# Altium project SCB.PrjPCB (part 6 of 8)

## Sheet Power_Supply.SchDoc: Power_Supply
size A3; Date: 18/06/2014; DrawnBy: J. Gabriel R.E.; Organization: Seven Solutions S.L.; Address1: C/Baza, Parcela 19, Nave 3; Address2: Polígono Ind. Juncaril; Address3: 18210-Peligros-Granada; Address4: Spain; Revision: 3.4; SheetNumber: 2; SheetTotal: 23; WebAddress: www.sevensols.com; Project: White Rabbit; ProjectName: Project Name
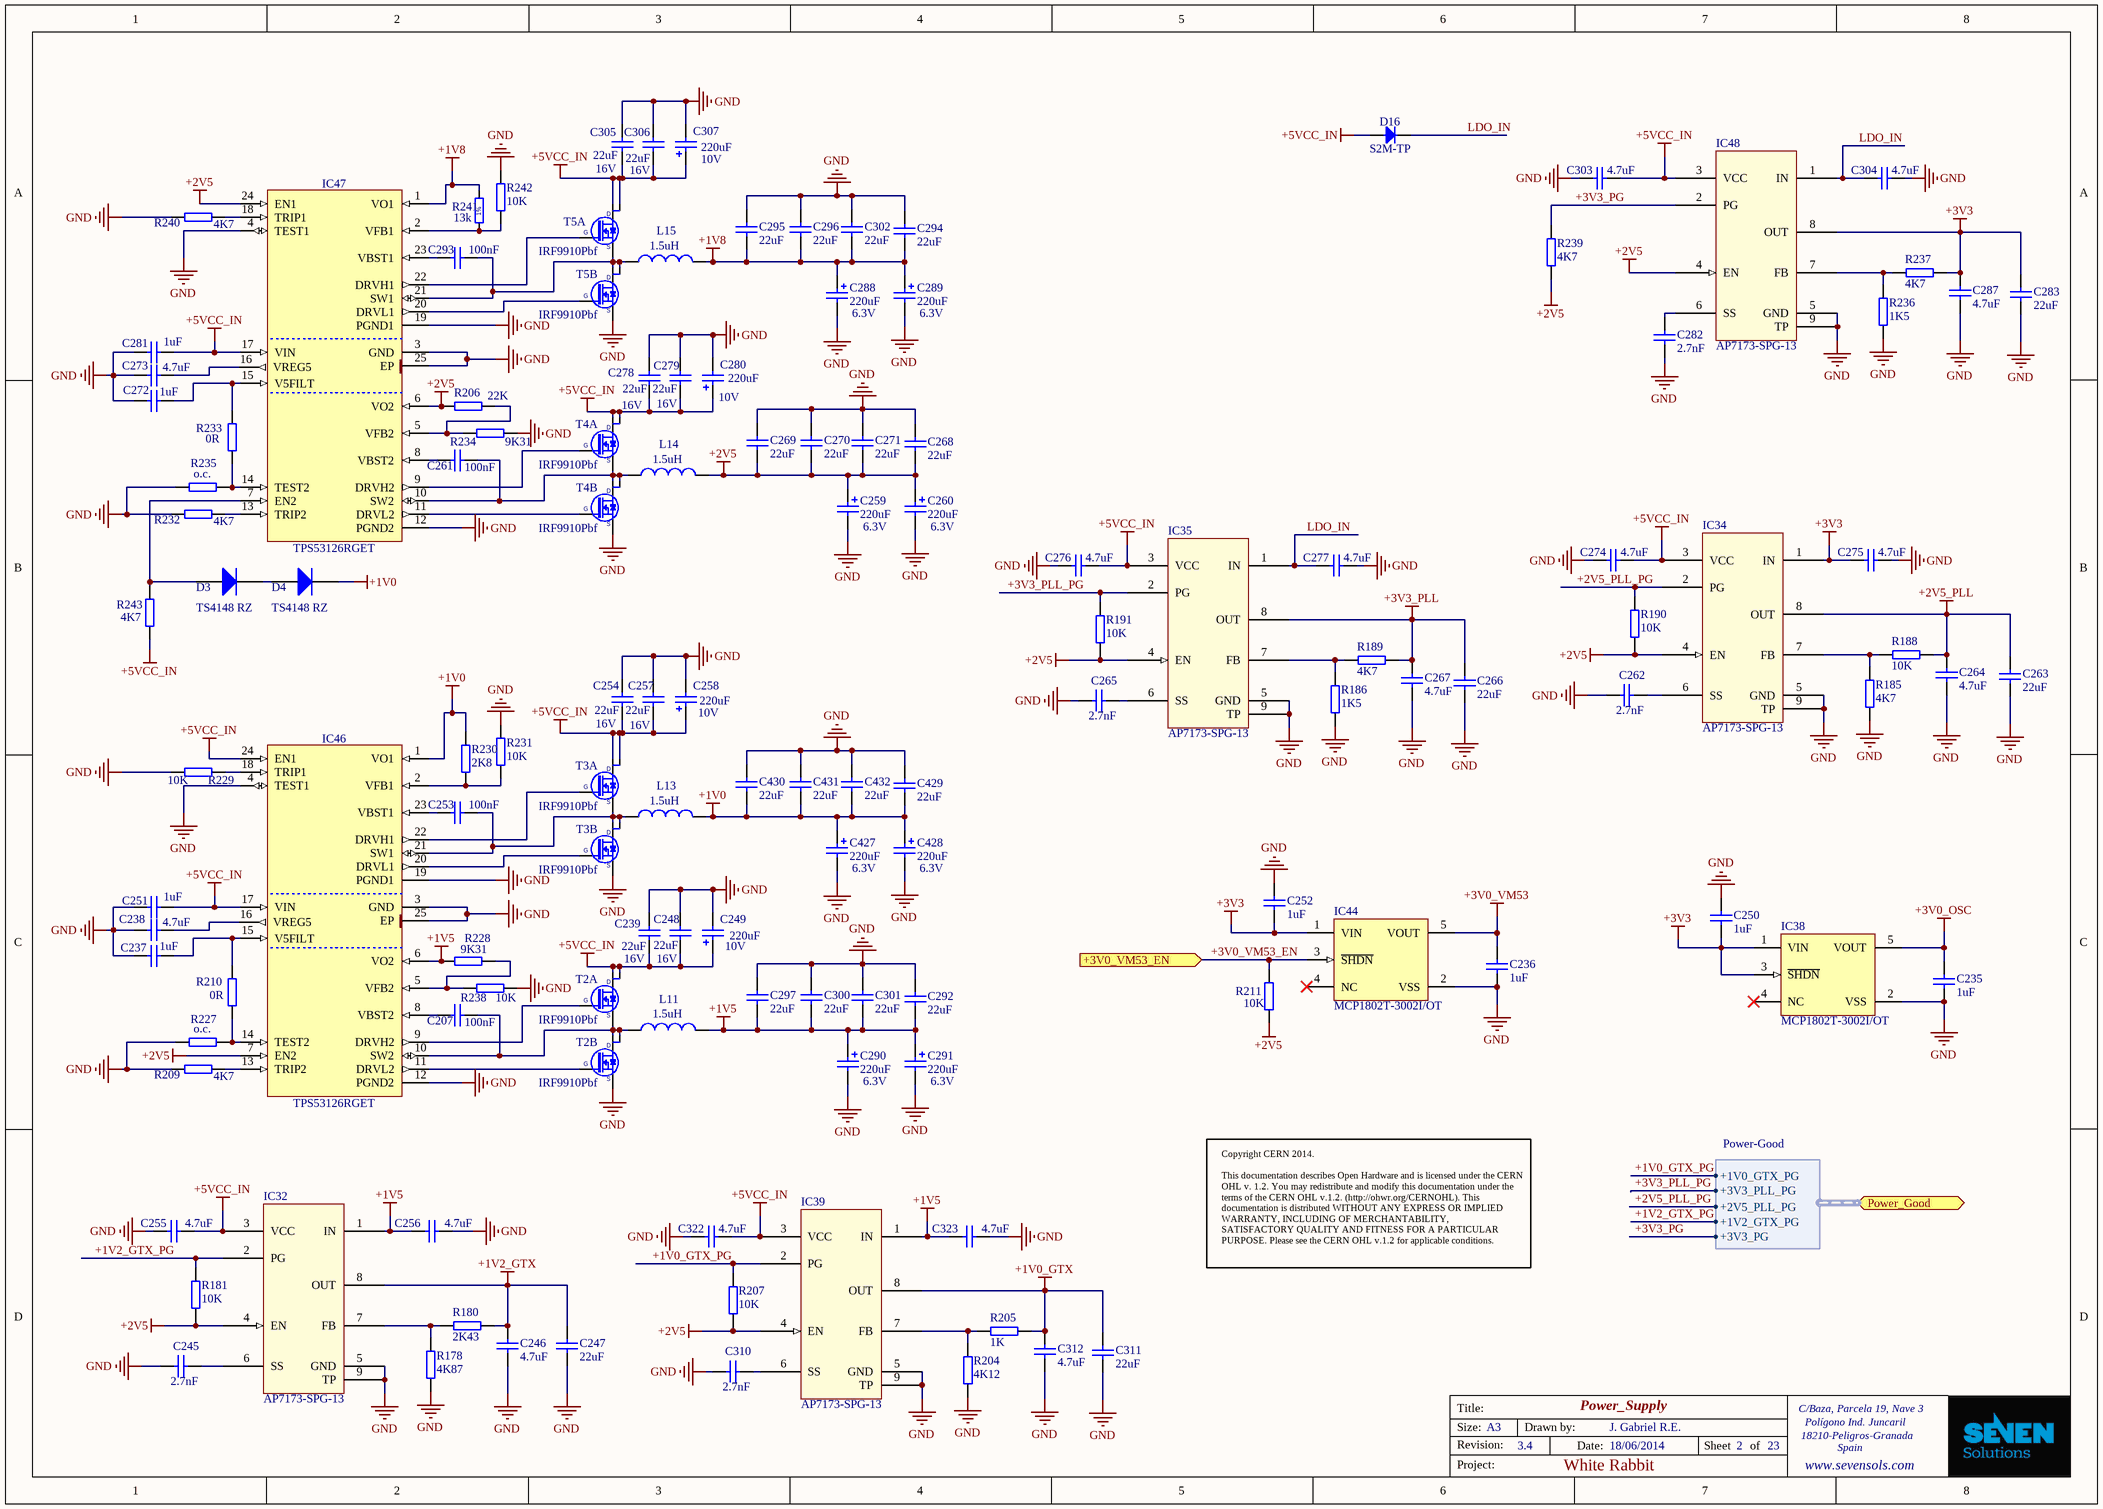
[diagram p16: Power_Supply.SchDoc]

### Parts
C207  100nF  [CC1005-0402]
C235  1uF  [CC1005-0402]
C236  1uF  [CC1005-0402]
C237  1uF  [CC1005-0402]
C238  4.7uF  [CC1608-0603]
C239  value 22uF  Voltage: 16V  [CC2012-0805]  (hidden comment: 22uF 16V)
C245  2.7nF  [CC1005-0402]
C246  4.7uF  [CC1608-0603]
C247  22uF  [CC2012-0805]
C248  value 22uF  Voltage: 16V  [CC2012-0805]  (hidden comment: 22uF 16V)
C249  value 220uF  Voltage: 10V  [D]  (hidden comment: 220uF 10V)
C250  1uF  [CC1005-0402]
C251  1uF  [CC1005-0402]
C252  1uF  [CC1005-0402]
C253  100nF  [CC1005-0402]
C254  value 22uF  Voltage: 16V  [CC2012-0805]  (hidden comment: 22uF 16V)
C255  4.7uF  [CC1608-0603]
C256  4.7uF  [CC1608-0603]
C257  value 22uF  Voltage: 16V  [CC2012-0805]  (hidden comment: 22uF 16V)
C258  value 220uF  Voltage: 10V  [D]  (hidden comment: 220uF 10V)
C259  Voltage: 6.3V  [D]  (hidden comment: 220uF)
C260  Voltage: 6.3V  [D]  (hidden comment: 220uF)
C261  100nF  [CC1005-0402]
C262  2.7nF  [CC1005-0402]
C263  22uF  [CC2012-0805]
C264  4.7uF  [CC1608-0603]
C265  2.7nF  [CC1005-0402]
C266  22uF  [CC2012-0805]
C267  4.7uF  [CC1608-0603]
C268  22uF  [CC2012-0805]
C269  22uF  [CC2012-0805]
C270  22uF  [CC2012-0805]
C271  22uF  [CC2012-0805]
C272  1uF  [CC1005-0402]
C273  4.7uF  [CC1608-0603]
C274  4.7uF  [CC1608-0603]
C275  4.7uF  [CC1608-0603]
C276  4.7uF  [CC1608-0603]
C277  4.7uF  [CC1608-0603]
C278  value 22uF  Voltage: 16V  [CC2012-0805]  (hidden comment: 22uF 16V)
C279  value 22uF  Voltage: 16V  [CC2012-0805]  (hidden comment: 22uF 16V)
C280  value 220uF  Voltage: 10V  [D]  (hidden comment: 220uF 10V)
C281  1uF  [CC1005-0402]
C282  2.7nF  [CC1005-0402]
C283  22uF  [CC2012-0805]
C287  4.7uF  [CC1608-0603]
C288  Voltage: 6.3V  [D]  (hidden comment: 220uF)
C289  Voltage: 6.3V  [D]  (hidden comment: 220uF)
C290  Voltage: 6.3V  [D]  (hidden comment: 220uF)
C291  Voltage: 6.3V  [D]  (hidden comment: 220uF)
C292  22uF  [CC2012-0805]
C293  100nF  [CC1005-0402]
C294  22uF  [CC2012-0805]
C295  22uF  [CC2012-0805]
C296  22uF  [CC2012-0805]
C297  22uF  [CC2012-0805]
C300  22uF  [CC2012-0805]
C301  22uF  [CC2012-0805]
C302  22uF  [CC2012-0805]
C303  4.7uF  [CC1608-0603]
C304  4.7uF  [CC1608-0603]
C305  value 22uF  Voltage: 16V  [CC2012-0805]  (hidden comment: 22uF 16V)
C306  value 22uF  Voltage: 16V  [CC2012-0805]  (hidden comment: 22uF 16V)
C307  value 220uF  Voltage: 10V  [D]  (hidden comment: 220uF 10V)
C310  2.7nF  [CC1005-0402]
C311  22uF  [CC2012-0805]
C312  4.7uF  [CC1608-0603]
C322  4.7uF  [CC1608-0603]
C323  4.7uF  [CC1608-0603]
C427  Voltage: 6.3V  [D]  (hidden comment: 220uF)
C428  Voltage: 6.3V  [D]  (hidden comment: 220uF)
C429  22uF  [CC2012-0805]
C430  22uF  [CC2012-0805]
C431  22uF  [CC2012-0805]
C432  22uF  [CC2012-0805]
D3  TS4148 RZ  [CD1608-0603]
D4  TS4148 RZ  [CD1608-0603]
D16  S2M-TP  [DO-214AA/SMB-MCC]
IC32  AP7173-SPG-13  [SOIC127P600-8AL-ThermalPad]
IC34  AP7173-SPG-13  [SOIC127P600-8AL-ThermalPad]
IC35  AP7173-SPG-13  [SOIC127P600-8AL-ThermalPad]
IC38  MCP1802T-3002I/OT  [SOT-23-OT5_N]
IC39  AP7173-SPG-13  [SOIC127P600-8AL-ThermalPad]
IC44  MCP1802T-3002I/OT  [SOT-23-OT5_N]
IC46  TPS53126RGET  [QFN50P400X400X100-25N-S255]
IC47  TPS53126RGET  [QFN50P400X400X100-25N-S255]
IC48  AP7173-SPG-13  [SOIC127P600-8AL-ThermalPad]
L11  value 1.5uH  [IHLP2525]  (hidden comment: IHLP2525CZER1R5M01)
L13  value 1.5uH  [IHLP2525]  (hidden comment: IHLP2525CZER1R5M01)
L14  value 1.5uH  [IHLP2525]  (hidden comment: IHLP2525CZER1R5M01)
L15  value 1.5uH  [IHLP2525]  (hidden comment: IHLP2525CZER1R5M01)
R178  4K87  [0402]
R180  2K43  [0402]
R181  10k  [0402]
R185  4K7  [0402]
R186  1K5  [0402]
R188  10K  [0402]
R189  4K7  [0402]
R190  10k  [0402]
R191  10k  [0402]
R204  4K12  [0402]
R205  1K  [0402]
R206  22K  [0402]
R207  10K  [0402]
R209  4K7  [0402]
R210  value 0R  [0402]  (hidden comment: Jumper)
R211  10k  [0402]
R227  o.c.  [0402]
R228  9K31  [0402]
R229  10K  [0402]
R230  2K8  [0402]
R231  10K  [0402]
R232  4K7  [0402]
R233  value 0R  [0402]  (hidden comment: Jumper)
R234  9K31  [0402]
R235  o.c.  [0402]
R236  1K5  [0402]
R237  4K7  [0402]
R238  10K  [0402]
R239  4K7  [0402]
R240  4K7  [0402]
R241  13k  [RESC1005X40N]
R242  10K  [0402]
R243  4K7  [0402]
T2  IRF9910Pbf  [SOIC127P600X175-8N]  (parts A,B of 2)
T3  IRF9910Pbf  [SOIC127P600X175-8N]  (parts A,B of 2)
T4  IRF9910Pbf  [SOIC127P600X175-8N]  (parts A,B of 2)
T5  IRF9910Pbf  [SOIC127P600X175-8N]  (parts A,B of 2)

### Ports
+3V0_VM53_EN (in), Power_Good (harness Power-Good)

### Harnesses
Power-Good: +1V2_GTX_PG, +2V5_PLL_PG, +3V3_PLL_PG, +1V0_GTX_PG, +3V3_PG

### Nets
+1V0: C427.1 C428.1 C429.1 C430.2 C431.1 C432.1 D4.2(K) IC46.1(VO1) L13.2 R230.2
+1V0_GTX: C311.2 C312.2 IC39.8(OUT) R205.2
+1V2_GTX: C246.2 C247.2 IC32.8(OUT) R180.2
+1V5: C256.1 C290.1 C291.1 C292.1 C297.2 C300.1 C301.1 C323.1 IC32.1(IN) IC39.1(IN) IC46.6(VO2) L11.2 R228.1
+1V8: C288.1 C289.1 C294.1 C295.2 C296.1 C302.1 IC47.1(VO1) L15.2 R241.2
+2V5: C259.1 C260.1 C268.1 C269.2 C270.1 C271.1 IC32.4(EN) IC34.4(EN) IC35.4(EN) IC39.4(EN) IC46.7(EN2) IC47.6(VO2) IC47.24(EN1) IC48.4(EN) L14.2 R181.1 R190.1 R191.1 R206.2 R207.1 R211.2 R239.1
+2V5_PLL: C263.2 C264.2 IC34.8(OUT) R188.1
+3V0_OSC: C235.2 IC38.5(VOUT)
+3V0_VM53: C236.2 IC44.5(VOUT)
+3V3: C250.2 C252.2 C275.1 C283.2 C287.2 IC34.1(IN) IC38.1(VIN) IC38.3(~{SHDN}) IC44.1(VIN) IC48.8(OUT) R237.2
+3V3_PLL: C266.2 C267.2 IC35.8(OUT) R189.1
+5VCC_IN: C239.1 C248.1 C249.1 C251.2 C254.1 C255.2 C257.1 C258.1 C274.2 C276.2 C278.1 C279.1 C280.1 C281.2 C303.2 C305.1 C306.1 C307.1 C322.2 D16.2(A) IC32.3(VCC) IC34.3(VCC) IC35.3(VCC) IC39.3(VCC) IC46.17(VIN) IC46.24(EN1) IC47.17(VIN) IC48.3(VCC) R243.2 T2.5(D) T2.6(D) T3.5(D) T3.6(D) T4.5(D) T4.6(D) T5.5(D) T5.6(D)
GND: C235.1 C236.1 C237.1 C238.2 C239.2 C245.1 C246.1 C247.1 C248.2 C249.2 C250.1 C251.1 C252.1 C254.2 C255.1 C256.2 C257.2 C258.2 C259.2 C260.2 C262.1 C263.1 C264.1 C265.1 C266.1 C267.1 C268.2 C269.1 C270.2 C271.2 C272.1 C273.2 C274.1 C275.2 C276.1 C277.2 C278.2 C279.2 C280.2 C281.1 C282.1 C283.1 C287.1 C288.2 C289.2 C290.2 C291.2 C292.2 C294.2 C295.1 C296.2 C297.1 C300.2 C301.2 C302.2 C303.1 C304.2 C305.2 C306.2 C307.2 C310.1 C311.1 C312.1 C322.1 C323.2 C427.2 C428.2 C429.2 C430.1 C431.2 C432.2 IC32.5(GND) IC32.9(TP) IC34.5(GND) IC34.9(TP) IC35.5(GND) IC35.9(TP) IC38.2(VSS) IC39.5(GND) IC39.9(TP) IC44.2(VSS) IC46.3(GND) IC46.4(TEST1) IC46.12(PGND2) IC46.19(PGND1) IC46.25(EP) IC47.3(GND) IC47.4(TEST1) IC47.12(PGND2) IC47.19(PGND1) IC47.25(EP) IC48.5(GND) IC48.9(TP) R178.1 R185.1 R186.1 R204.1 R209.2 R227.1 R229.2 R231.2 R232.2 R234.2 R235.1 R236.1 R238.2 R240.2 R242.2 T2.1(S) T3.1(S) T4.1(S) T5.1(S)
+1V0_GTX_PG: IC39.2(PG) R207.2 ; port Power_Good.+1V0_GTX_PG
+1V2_GTX_PG: IC32.2(PG) R181.2 ; port Power_Good.+1V2_GTX_PG
+2V5_PLL_PG: IC34.2(PG) R190.2 ; port Power_Good.+2V5_PLL_PG
+3V0_VM53_EN: IC44.3(~{SHDN}) R211.1 ; port +3V0_VM53_EN
+3V3_PG: IC48.2(PG) R239.2 ; port Power_Good.+3V3_PG
+3V3_PLL_PG: IC35.2(PG) R191.2 ; port Power_Good.+3V3_PLL_PG
LDO_IN: C277.1 C304.1 D16.1(C) IC35.1(IN) IC48.1(IN)
NetC207_1: C207.1 IC46.8(VBST2)
NetC207_2: C207.2 IC46.10(SW2) L11.1 T2.3(S) T2.7(D) T2.8(D)
NetC237_2: C237.2 IC46.15(V5FILT) R210.1
NetC238_1: C238.1 IC46.16(VREG5)
NetC245_2: C245.2 IC32.6(SS)
NetC253_1: C253.1 IC46.23(VBST1)
NetC253_2: C253.2 IC46.21(SW1) L13.1 T3.3(S) T3.7(D) T3.8(D)
NetC261_1: C261.1 IC47.8(VBST2)
NetC261_2: C261.2 IC47.10(SW2) L14.1 T4.3(S) T4.7(D) T4.8(D)
NetC262_2: C262.2 IC34.6(SS)
NetC265_2: C265.2 IC35.6(SS)
NetC272_2: C272.2 IC47.15(V5FILT) R233.1
NetC273_1: C273.1 IC47.16(VREG5)
NetC282_2: C282.2 IC48.6(SS)
NetC293_1: C293.1 IC47.23(VBST1)
NetC293_2: C293.2 IC47.21(SW1) L15.1 T5.3(S) T5.7(D) T5.8(D)
NetC310_2: C310.2 IC39.6(SS)
NetD3_1: D3.1(A) IC47.7(EN2) R243.1
NetD3_2: D3.2(K) D4.1(A)
NetIC32_7: IC32.7(FB) R178.2 R180.1
NetIC34_7: IC34.7(FB) R185.2 R188.2
NetIC35_7: IC35.7(FB) R186.2 R189.2
NetIC39_7: IC39.7(FB) R204.2 R205.1
NetIC46_2: IC46.2(VFB1) R230.1 R231.1
NetIC46_5: IC46.5(VFB2) R228.2 R238.1
NetIC46_9: IC46.9(DRVH2) T2.4(G)
NetIC46_11: IC46.11(DRVL2) T2.2(G)
NetIC46_13: IC46.13(TRIP2) R209.1
NetIC46_14: IC46.14(TEST2) R210.2 R227.2
NetIC46_18: IC46.18(TRIP1) R229.1
NetIC46_20: IC46.20(DRVL1) T3.2(G)
NetIC46_22: IC46.22(DRVH1) T3.4(G)
NetIC47_2: IC47.2(VFB1) R241.1 R242.1
NetIC47_5: IC47.5(VFB2) R206.1 R234.1
NetIC47_9: IC47.9(DRVH2) T4.4(G)
NetIC47_11: IC47.11(DRVL2) T4.2(G)
NetIC47_13: IC47.13(TRIP2) R232.1
NetIC47_14: IC47.14(TEST2) R233.2 R235.2
NetIC47_18: IC47.18(TRIP1) R240.1
NetIC47_20: IC47.20(DRVL1) T5.2(G)
NetIC47_22: IC47.22(DRVH1) T5.4(G)
NetIC48_7: IC48.7(FB) R236.2 R237.1

Not connected (* = marked no-connect by the designer): IC38 4(NC)*; IC44 4(NC)*

### Notes on the sheet
- Copyright CERN 2014.
  This documentation describes Open Hardware and is licensed under the CERN OHL v. 1.2. You may redistribute and modify this documentation under the terms of the CERN OHL v.1.2. (http://ohwr.org/CERNOHL). This documentation is distributed WITHOUT ANY EXPRESS OR IMPLIED WARRANTY, INCLUDING OF MERCHANTABILITY, SATISFACTORY QUALITY AND FITNESS FOR A PARTICULAR PURPOSE. Please see the CERN OHL v.1.2 for applicable conditions.
- Title:
- Size:
- Revision:
- A3
- Drawn by:
- Date:
- Sheet
- of
- Project:
- (in symbol R0402_13K_1%_0.0625W_100PPM) 1%

### Library data of the parts
C207 C253 C261 C293 = CC0402_100NF_16V_10%_X7R: Capacitor; Manufacturer1: TDK; Manufacturer1 PN: C1005X7R1C104K; TC: X7R; Tolerance: ±10%; Voltage: 16V; Published: 8-Jun-2000; LatestRevisionDate: 17-Jul-2002; LatestRevisionNote: Re-released for DXP Platform.; PackageReference: RAD-0.3; Publisher: Altium Limited; Distributor1: Digikey; Distributor1 PN: 445-4952-1-ND; Case: 0402; Value: 100nF
C235-C237 C250-C252 C272 C281 = CC0402_1UF_16V_10%_X5R: Capacitor; Manufacturer1: TDK; Manufacturer1 PN: C1005X5R1C105K; TC: X5R; Tolerance: ±10%; Voltage: 16V; Published: 8-Jun-2000; LatestRevisionDate: 17-Jul-2002; LatestRevisionNote: Re-released for DXP Platform.; PackageReference: RAD-0.3; Publisher: Altium Limited; Distributor1: Digikey; Distributor1 PN: 445-4978-1-ND; Case: 0402; Value: 1uF
C238 C246 C255 C256 C264 C267 C273-C277 C287 C303 C304 C312 C322 C323 = CC0603_4.7UF_10V_10%_X5R: Capacitor; Manufacturer1: TDK; Manufacturer1 PN: C1608X5R1A475K; TC: X5R; Tolerance: ±10%; Voltage: 10V; Published: 8-Jun-2000; LatestRevisionDate: 17-Jul-2002; LatestRevisionNote: Re-released for DXP Platform.; PackageReference: RAD-0.3; Publisher: Altium Limited; Distributor1: Digikey; Distributor1 PN: 445-5170-1-ND; Case: 0603; Value: 4.7uF
C239 C248 C254 C257 C278 C279 C305 C306 = CC0805_22UF_16V_10%_X5R: Capacitor; Manufacturer1: Phycomp; Manufacturer1 PN: C2012X5R1C226K; TC: X7R; Tolerance: ±10%; Published: 8-Jun-2000; LatestRevisionDate: 17-Jul-2002; LatestRevisionNote: Re-released for DXP Platform.; PackageReference: RAD-0.3; Publisher: Altium Limited; Distributor1: Digikey; Distributor1 PN: 445-6797-1-ND; Case: 0805
C245 C262 C265 C282 C310 = CC0402_2.7NF_50V_10%_X7R: Capacitor; Manufacturer1: Panasonic; Manufacturer1 PN: ECJ-0EB1H272K; TC: X7R; Tolerance: ±10%; Voltage: 50V; Published: 8-Jun-2000; LatestRevisionDate: 17-Jul-2002; LatestRevisionNote: Re-released for DXP Platform.; PackageReference: RAD-0.3; Publisher: Altium Limited; Distributor1: Digikey; Distributor1 PN: PCC1726CT-ND; Case: 0402; Value: 2.7nF
C247 C263 C266 C268-C271 C283 C292 C294-C297 C300-C302 C311 C429-C432 = CC0805_22UF_6.3V_20%_X5R: Capacitor; Manufacturer1: TDK; Manufacturer1 PN: C2012X5R0J226M; TC: X5R; Tolerance: ±20%; Voltage: 6.3V; Published: 8-Jun-2000; LatestRevisionDate: 17-Jul-2002; LatestRevisionNote: Re-released for DXP Platform.; PackageReference: RAD-0.3; Publisher: Altium Limited; Distributor1: Digikey; Distributor1 PN: 445-1422-1-ND; Case: 0805; Value: 22uF
C249 C258 C280 C307 = CP2917_220UF_10V_20%_TANT: Polarized Capacitor Tantalum; Manufacturer1: Kemet; Manufacturer1 PN: T520D227M010ATE018; Tolerance: ±20%; ESR: 18mOhm; Published: 8-Jun-2000; LatestRevisionDate: 17-Jul-2002; LatestRevisionNote: Re-released for DXP Platform.; PackageReference: RB7.6-15; Publisher: Altium Limited; Case: 2917; Distributor1: Digikey; Distributor1 PN: 399-4045-1-ND; TC: Tantalum
C259 C260 C288-C291 C427 C428 = CP2917_220UF_6.3V_20%_TANT: Polarized Capacitor Tantalum; Manufacturer1: Kemet; Manufacturer1 PN: T520D227M006ATE009; Tolerance: ±20%; ESR: 9mOhm; Published: 8-Jun-2000; LatestRevisionDate: 17-Jul-2002; LatestRevisionNote: Re-released for DXP Platform.; PackageReference: RB7.6-15; Publisher: Altium Limited; Case: 2917; Distributor1: Digikey; Distributor1 PN: T520D227M006ATE009; TC: Tantalum; Value: 220uF
D3 D4 = Diode: Default Diode; Published: 8-Jun-2000; LatestRevisionDate: 17-Jul-2002; LatestRevisionNote: Re-released for DXP Platform.; PackageDocument: Sep-1996; PackageReference: SMC; Publisher: Altium Limited; Code_JEDEC: DO-214-AB; Value: TS4148 RZ; Distributor1 PN: 8150192; Distributor1: Farnell
D16 = S2M-TP: 2 A Silicon Rectifier 50 to 1000 Volts; Manufacturer1: Micro Commercial Components; Author: CERN DEM JLC; Manufacturer1 PN: S2M-TP; Distributor1: Digikey; Distributor1 PN: S2M-TPMSCT-ND
IC32 IC34 IC35 IC39 IC48 = AP7173: 1.5A Low Dropout Linera Regulator; Value: AP7173-SPG-13; Distributor1 PN: AP7173-SPG-13DICT-ND; Distributor1: Digikey
IC38 IC44 = MCP1802T-3002I/OT: 300 mA, High PSRR, Low Quiescent Current LDO, 5-Pin SOT-23, Industrial Temperature, Tape and Reel; FirstPublished: 29-Jan-2009; LatestRevisionDate: 02-Dec-2009; LatestRevisionNote: Updated to datasheet revision B, Jan-2009; DatasheetVersion: revB, Jan-2009; PackageVersion: revBB, Aug-2009; PackageReference: SOT-23-OT5; Publisher: Altium Limited; PackageDescription: 5-Lead Plastic Small Outline Transistor (OT) [SOT-23]; Supplier 1: Digi-Key; Supplier Part Number 1: MCP1802T-3002I/OTTR-ND; Supplier 2: Digi-Key; Supplier Part Number 2: MCP1802T-3002I/OTCT-ND; Supplier 3: Digi-Key; Supplier Part Number 3: MCP1802T-3002I/OTDKR-ND; Supplier 4: Farnell; Supplier Part Number 4: 1578373; Supplier 5: Newark; Supplier Part Number 5: 54M4837; Code_IPC: SOT23-5; ComponentLink1Description: Datasheet; ComponentLink1URL: http://ww1.microchip.com/downloads/en/DeviceDoc/22053b.pdf; ComponentLink2Description: Packaging Specification; ComponentLink2URL: http://www.microchip.com/stellent/groups/techpub_sg/documents/packagingspec/en012702.pdf; ComponentLink3Description: Microchip.com Home; ComponentLink3URL: http://www.microchip.com/
IC46 IC47 = TPS53126RGET: Dual Synchronous Step-Down Controller For Low Voltage Power Rails; Manufacturer: TEXAS INSTRUMENTS; Table: Analog & Interface; Part Number: TPS53126RGET; Component Kind: Standard; Component Type: Standard; Device: TPS53126RGET; PackageDescription: QFN,0.50mm pitch,square;6 pin X 6 pin,4.15mm X 4.15mm X 1.00mm H body (w/thermal tab 2.55 X 2.55mm),  IPC Medium Density; Part Description: Dual Synchronous Step-Down Controller For Low Voltage Power Rails; Manufacturer Part Number: TPS53126RGET; Pin Count: 25; Case: QFN24; Mounted: Yes; Socket: No; SMD: Yes; ComponentHeight: 1.0mm; Author: CERN DEM JLC; HelpURL: \\cern.ch\dfs\Applications\Altium\Datasheets\TPS53126RGET.pdf; CreateDate: 2010-08-26; LatestRevisionDate: 2010-08-26
L11 L13-L15 = Inductor: Low Profile, High Current Inductor; Manufacturer: Vishay/Dale; Published: 8-Jun-2000; Revision: July-2002: Re-released for DXP Platform.; Publisher: Altium Limited; Manufacturer PN: IHLP2525CZER1R5M01; Distributor1 PN: 541-1007-1-ND; Distributor1: Digikey
R178 = R0402_4K87_±1%_0.1W_100PPM: SMD Resistor; Manufacturer1: Panasonic; Manufacturer1 PN: ERJ-2RKF4871X; TCR: 100ppm; Power Rating: 0.1W; Tolerance: ±1%; Case: 0402; Distributor1: DigiKey; Distributor1 PN: P4.87KLCT-ND; Value: 4K87
R180 = R0402_2K43_±1%_0.1W_100PPM: SMD Resistor; Manufacturer1: Panasonic; Manufacturer1 PN: ERJ-2RKF2431X; TCR: 100ppm; Power Rating: 0.1W; Tolerance: ±1%; Case: 0402; Distributor1: DigiKey; Distributor1 PN: P2.43KLCT-ND; Value: 2K43
R181 R188 R190 R191 R207 R211 R229 R231 R238 R242 = R0402_10K_±1%_0.1W_100PPM: SMD Resistor; Manufacturer1: Panasonic; Manufacturer1 PN: ERJ-2RKF1002X; TCR: 100ppm; Power Rating: 0.1W; Tolerance: ±1%; Case: 0402; Distributor1: DigiKey; Distributor1 PN: P10.0KLCT-ND; Value: 10K
R185 R189 R209 R232 R237 R239 R240 R243 = R0402_4.7K_±1%_0.1W_100PPM: SMD Resistor; Manufacturer1: Panasonic; Manufacturer1 PN: ERJ-2RKF4701X; TCR: 100ppm; Power Rating: 0.1W; Tolerance: ±1%; Case: 0402; Distributor1: DigiKey; Distributor1 PN: ERJ-2RKF4701X; Value: 4K7
R186 R236 = R0402_1K5_±1%_0.1W_100PPM: SMD Resistor; Manufacturer1: Panasonic; Manufacturer1 PN: ERJ-2RKF1501X; TCR: 100ppm; Power Rating: 0.1W; Tolerance: ±1%; Case: 0402; Distributor1: DigiKey; Distributor1 PN: P1.50KLCT-ND; Value: 1K5
R204 = R0402_4K12_±1%_0.1W_100PPM: SMD Resistor; Manufacturer1: Panasonic; Manufacturer1 PN: ERJ-2RKF4121X; TCR: 100ppm; Power Rating: 0.1W; Tolerance: ±1%; Case: 0402; Distributor1: DigiKey; Distributor1 PN: P4.12KLCT-ND; Value: 4K12
R205 = R0402_1K_±1%_0.1W_100PPM: SMD Resistor; Manufacturer1: Panasonic; Manufacturer1 PN: ERJ-2RKF1001X; TCR: 100ppm; Power Rating: 0.1W; Tolerance: ±1%; Case: 0402; Distributor1: DigiKey; Distributor1 PN: P1.00KLCT-ND; Value: 1K
R206 = R0402_22K_±1%_0.1W_100PPM: SMD Resistor; Manufacturer1: Panasonic; Manufacturer1 PN: ERJ-2RKF2202X; TCR: 100ppm; Power Rating: 0.1W; Tolerance: ±1%; Case: 0402; Distributor1: DigiKey; Distributor1 PN: P22.0KLCT-ND; Value: 22K
R210 R233 = R0402_0R_0.1W_JUMPER: SMD Resistor; Manufacturer1: Panasonic; Manufacturer1 PN: ERJ-2GE0R00X; TCR: 100ppm; Power Rating: 0.1W; Case: 0402; Distributor1: DigiKey; Distributor1 PN: P0.0JCT-ND; Tolerance: Jumper
R227 R235 = R0402_O.C.: SMD Resistor; Mounted: No; Case: 0402; Manufacturer1: N/A; Manufacturer1 PN: N/A; Distributor1: N/A; Distributor1 PN: N/A; TCR: N/A; Power Rating: N/A; Tolerance: N/A; Value: o.c.
R228 R234 = R0402_9K31_±1%_0.1W_100PPM: SMD Resistor; Manufacturer1: Panasonic; Manufacturer1 PN: ERJ-2RKF9311X; TCR: 100ppm; Power Rating: 0.1W; Tolerance: ±1%; Case: 0402; Distributor1: DigiKey; Distributor1 PN: P9.31KLCT-ND; Value: 9K31
R230 = R0402_2K8_±1%_0.1W_100PPM: SMD Resistor; Manufacturer1: Panasonic; Manufacturer1 PN: ERJ-2RKF2801X; TCR: 100ppm; Power Rating: 0.1W; Tolerance: ±1%; Case: 0402; Distributor1: DigiKey; Distributor1 PN: P2.80KLCT-ND; Value: 2K8
R241 = R0402_13K_1%_0.0625W_100PPM: Resistor - 1%; Part Description: General Purpose Thick Film Chip Resistor; Manufacturer: GENERIC; Manufacturer1 Part Number: 232270671303; TC: ±100ppm/°C; Table: Resistors SMD; Part Number: R0402_13K_1%_0.0625W_100PPM; Component Kind: Standard; Component Type: Standard; Pin Count: 2; Value: 13k; Status: Not recommended; Power: 0.0625W; Tolerance: ±1%; Manufacturer Part Number: R0402_13K_1%_0.0625W_100PPM; Case: 0402; Mounted: Yes; Socket: No; SMD: Yes; Manufacturer1 Example: PHYCOMP; Manufacturer1 ComponentHeight: 0.4mm; HelpURL: \\cern.ch\dfs\Applications\Altium\Datasheets\R0402_Phycomp_RC0402.pdf; Author: CERN DEM JLC; CreateDate: 03/12/2007; LatestRevisionDate: 13/03/2008
T2-T5 = IRF9910Pbf: Dual SO-8 MOSFET For POL Cconverter; Part Description: 20V 10A(Q1) 20V 12A (Q2) Dual SO-8 MOSFET For POL Cconverter; Manufacturer: INTERNATIONAL RECTIFIER; Table: Transistors; Part Number: IRF9910Pbf; Component Kind: Standard; Component Type: Standard; Device: IRF9910Pbf; PackageDescription: SOIC 8, Pitch 1.27mm - Body 4x5mm, IPC Medium Density; Manufacturer Part Number: IRF9910Pbf; Pin Count: 8; Case: DO8; Mounted: Yes; Socket: No; SMD: Yes; ComponentHeight: 1.75mm; HelpURL: \\cern.ch\dfs\Applications\Altium\Datasheets\IRF9910Pbf.pdf; Author: CERN DEM JLC; CreateDate: 30/08/2010; LatestRevisionDate: 30/08/2010

## Sheet FPGA_POWER_DGND.SchDoc: FPGA_PWER_DGND
size A3; Date: 18/06/2014; DrawnBy: J. Gabriel R.E.; Organization: Seven Solutions S.L.; Address1: C/Baza, Parcela 19, Nave 3; Address2: Polígono Ind. Juncaril; Address3: 18210-Peligros-Granada; Address4: Spain; Revision: 3.4; SheetNumber: 11; SheetTotal: 23; WebAddress: www.sevensols.com; Project: White Rabbit; ProjectName: Project Name
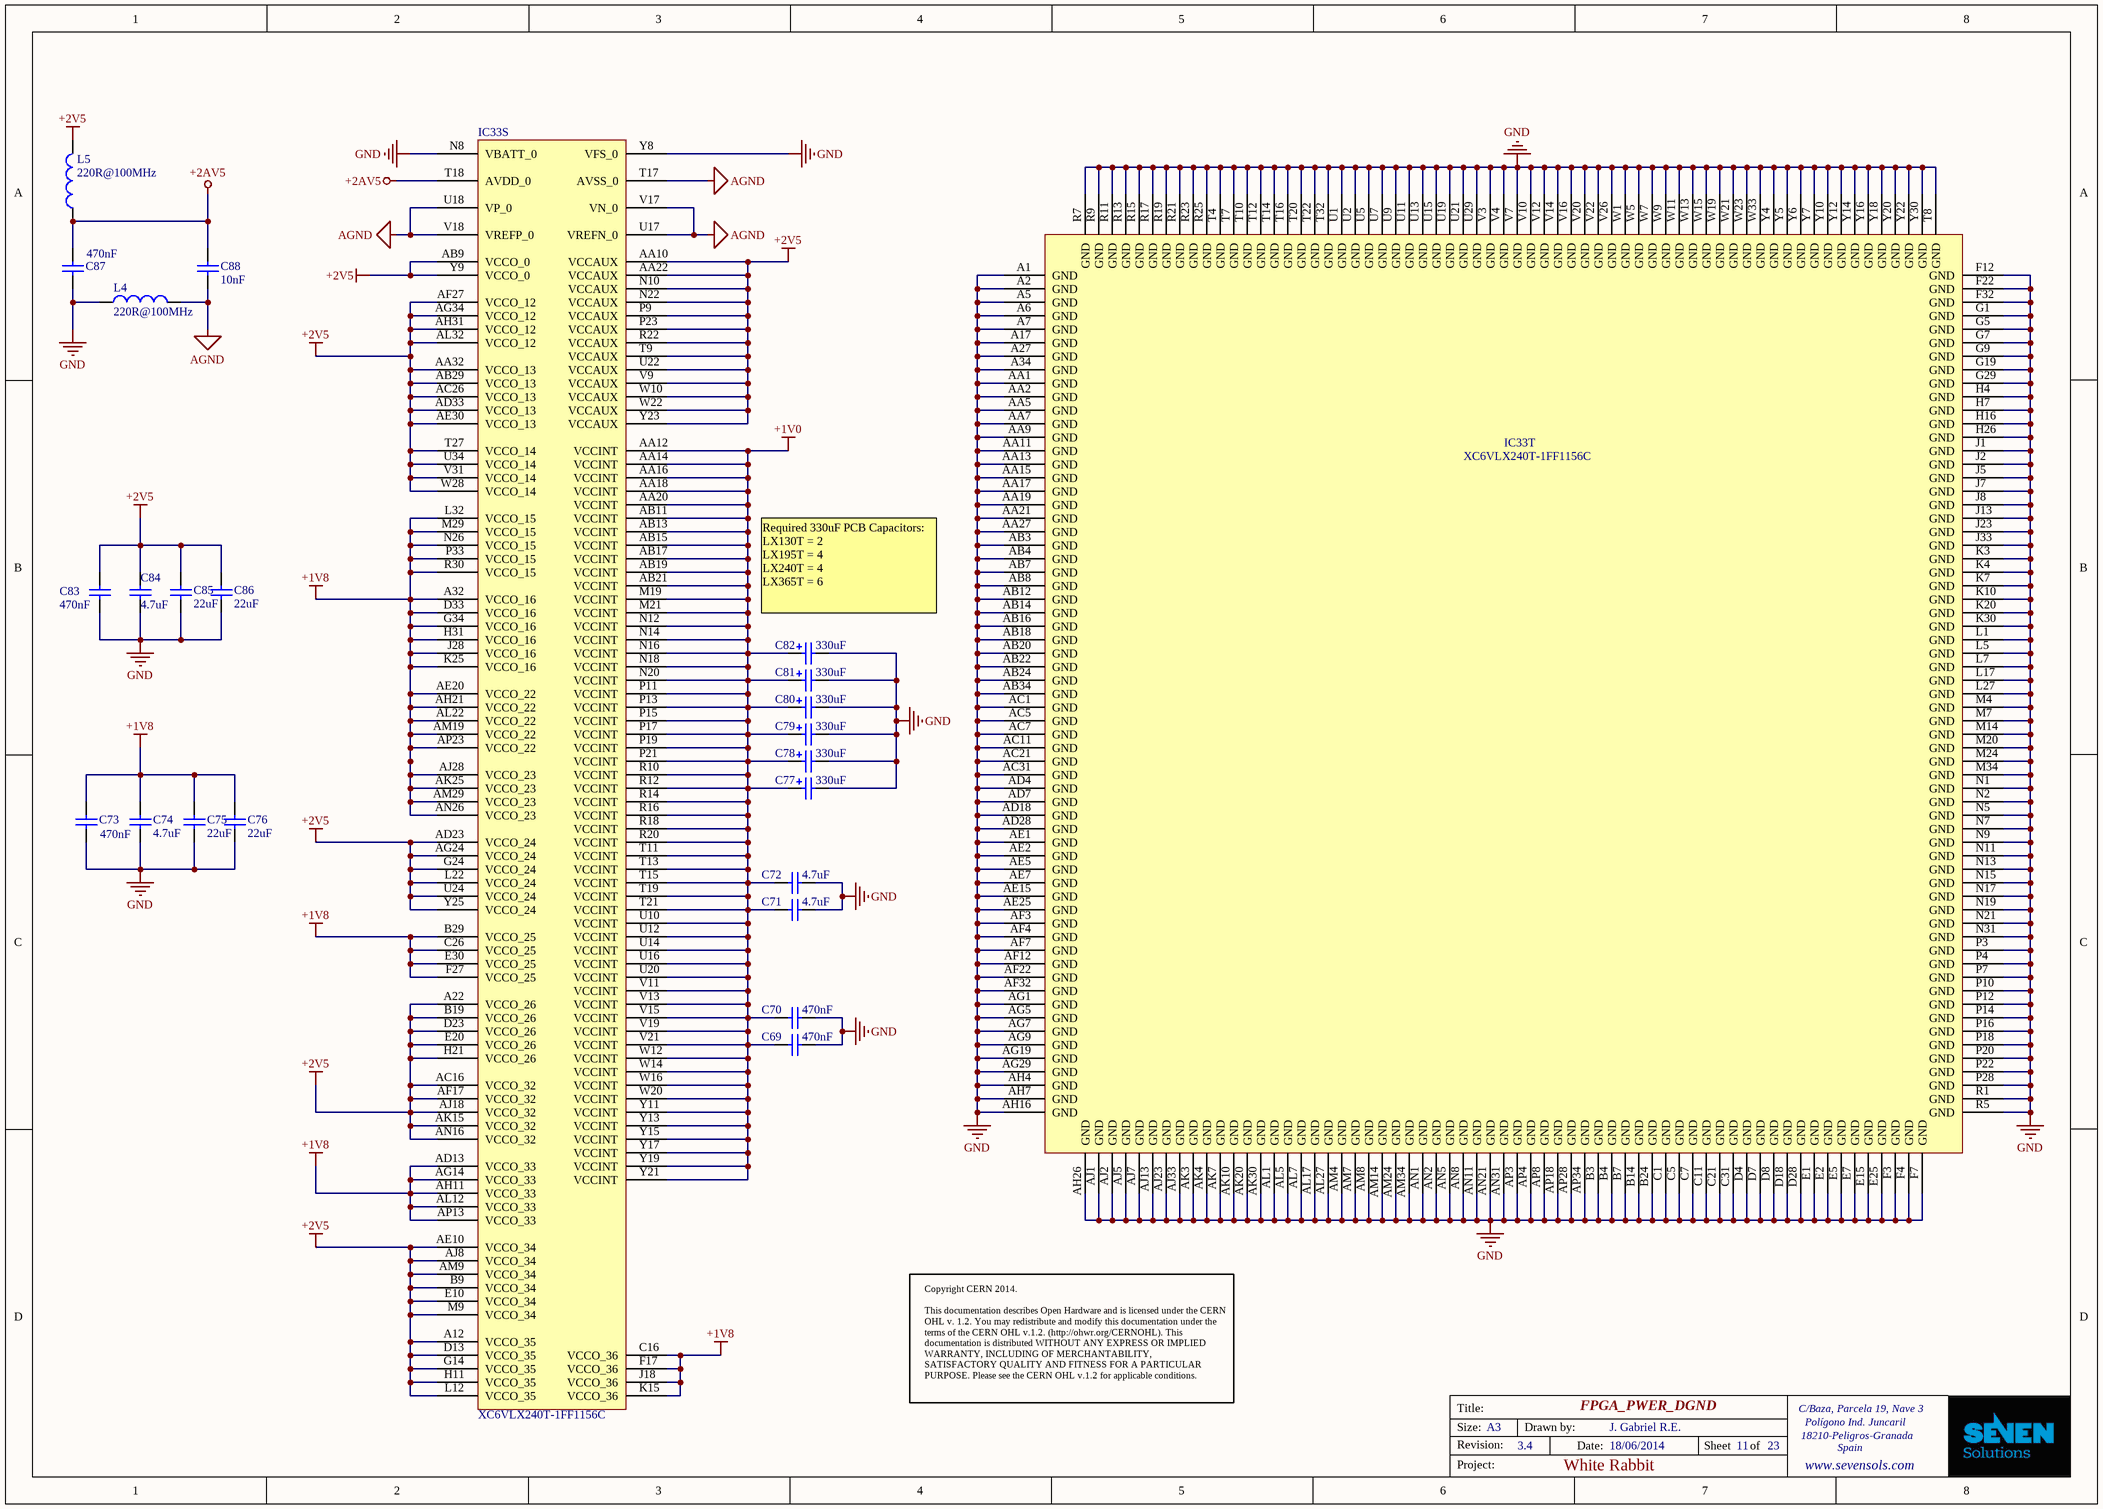
[diagram p17: FPGA_POWER_DGND.SchDoc]

### Parts
C69  470nF  [CC1005-0402]
C70  470nF  [CC1005-0402]
C71  4.7uF  [CC1608-0603]
C72  4.7uF  [CC1608-0603]
C73  470nF  [CC1005-0402]
C74  4.7uF  [CC1608-0603]
C75  22uF  [CC2012-0805]
C76  22uF  [CC2012-0805]
C77  330uF  [D]
C78  330uF  [D]
C79  330uF  [D]
C80  330uF  [D]
C81  330uF  [D]
C82  330uF  [D]
C83  470nF  [CC1005-0402]
C84  4.7uF  [CC1608-0603]
C85  22uF  [CC2012-0805]
C86  22uF  [CC2012-0805]
C87  470nF  [CC1005-0402]
C88  10nF  [CC1005-0402]
IC33  XC6VLX240T-1FF1156C  [FF1156]  (parts S,T of 20)
L4  Impedance: 220R@100MHz  [0603]  (hidden comment: 220R@100MHz Ferrite Bead)
L5  Impedance: 220R@100MHz  [0603]  (hidden comment: 220R@100MHz Ferrite Bead)

### Nets
+1V0: C69.2 C70.2 C71.1 C72.1 C77.1 C78.1 C79.1 C80.1 C81.1 C82.1 IC33.AA12(VCCINT) IC33.AA14(VCCINT) IC33.AA16(VCCINT) IC33.AA18(VCCINT) IC33.AA20(VCCINT) IC33.AB11(VCCINT) IC33.AB13(VCCINT) IC33.AB15(VCCINT) IC33.AB17(VCCINT) IC33.AB19(VCCINT) IC33.AB21(VCCINT) IC33.M19(VCCINT) IC33.M21(VCCINT) IC33.N12(VCCINT) IC33.N14(VCCINT) IC33.N16(VCCINT) IC33.N18(VCCINT) IC33.N20(VCCINT) IC33.P11(VCCINT) IC33.P13(VCCINT) IC33.P15(VCCINT) IC33.P17(VCCINT) IC33.P19(VCCINT) IC33.P21(VCCINT) IC33.R10(VCCINT) IC33.R12(VCCINT) IC33.R14(VCCINT) IC33.R16(VCCINT) IC33.R18(VCCINT) IC33.R20(VCCINT) IC33.T11(VCCINT) IC33.T13(VCCINT) IC33.T15(VCCINT) IC33.T19(VCCINT) IC33.T21(VCCINT) IC33.U10(VCCINT) IC33.U12(VCCINT) IC33.U14(VCCINT) IC33.U16(VCCINT) IC33.U20(VCCINT) IC33.V11(VCCINT) IC33.V13(VCCINT) IC33.V15(VCCINT) IC33.V19(VCCINT) IC33.V21(VCCINT) IC33.W12(VCCINT) IC33.W14(VCCINT) IC33.W16(VCCINT) IC33.W20(VCCINT) IC33.Y11(VCCINT) IC33.Y13(VCCINT) IC33.Y15(VCCINT) IC33.Y17(VCCINT) IC33.Y19(VCCINT) IC33.Y21(VCCINT)
+1V8: C73.1 C74.2 C75.2 C76.2 IC33.A32(VCCO_16) IC33.AD13(VCCO_33) IC33.AE20(VCCO_22) IC33.AG14(VCCO_33) IC33.AH11(VCCO_33) IC33.AH21(VCCO_22) IC33.AJ28(VCCO_23) IC33.AK25(VCCO_23) IC33.AL12(VCCO_33) IC33.AL22(VCCO_22) IC33.AM19(VCCO_22) IC33.AM29(VCCO_23) IC33.AN26(VCCO_23) IC33.AP13(VCCO_33) IC33.AP23(VCCO_22) IC33.B29(VCCO_25) IC33.C16(VCCO_36) IC33.C26(VCCO_25) IC33.D33(VCCO_16) IC33.E30(VCCO_25) IC33.F17(VCCO_36) IC33.F27(VCCO_25) IC33.G34(VCCO_16) IC33.H31(VCCO_16) IC33.J18(VCCO_36) IC33.J28(VCCO_16) IC33.K15(VCCO_36) IC33.K25(VCCO_16) IC33.L32(VCCO_15) IC33.M29(VCCO_15) IC33.N26(VCCO_15) IC33.P33(VCCO_15) IC33.R30(VCCO_15)
+2AV5: C87.1 C88.1 IC33.T18(AVDD_0) L5.1
+2V5: C83.1 C84.2 C85.2 C86.2 IC33.A12(VCCO_35) IC33.A22(VCCO_26) IC33.AA10(VCCAUX) IC33.AA22(VCCAUX) IC33.AA32(VCCO_13) IC33.AB9(VCCO_0) IC33.AB29(VCCO_13) IC33.AC16(VCCO_32) IC33.AC26(VCCO_13) IC33.AD23(VCCO_24) IC33.AD33(VCCO_13) IC33.AE10(VCCO_34) IC33.AE30(VCCO_13) IC33.AF17(VCCO_32) IC33.AF27(VCCO_12) IC33.AG24(VCCO_24) IC33.AG34(VCCO_12) IC33.AH31(VCCO_12) IC33.AJ8(VCCO_34) IC33.AJ18(VCCO_32) IC33.AK15(VCCO_32) IC33.AL32(VCCO_12) IC33.AM9(VCCO_34) IC33.AN16(VCCO_32) IC33.B9(VCCO_34) IC33.B19(VCCO_26) IC33.D13(VCCO_35) IC33.D23(VCCO_26) IC33.E10(VCCO_34) IC33.E20(VCCO_26) IC33.G14(VCCO_35) IC33.G24(VCCO_24) IC33.H11(VCCO_35) IC33.H21(VCCO_26) IC33.L12(VCCO_35) IC33.L22(VCCO_24) IC33.M9(VCCO_34) IC33.N10(VCCAUX) IC33.N22(VCCAUX) IC33.P9(VCCAUX) IC33.P23(VCCAUX) IC33.R22(VCCAUX) IC33.T9(VCCAUX) IC33.T27(VCCO_14) IC33.U22(VCCAUX) IC33.U24(VCCO_24) IC33.U34(VCCO_14) IC33.V9(VCCAUX) IC33.V31(VCCO_14) IC33.W10(VCCAUX) IC33.W22(VCCAUX) IC33.W28(VCCO_14) IC33.Y9(VCCO_0) IC33.Y23(VCCAUX) IC33.Y25(VCCO_24) L5.2
AGND: C88.2 IC33.T17(AVSS_0) IC33.U17(VREFN_0) IC33.U18(VP_0) IC33.V17(VN_0) IC33.V18(VREFP_0) L4.2
GND: C69.1 C70.1 C71.2 C72.2 C73.2 C74.1 C75.1 C76.1 C77.2 C78.2 C79.2 C80.2 C81.2 C82.2 C83.2 C84.1 C85.1 C86.1 C87.2 IC33.A1(GND) IC33.A2(GND) IC33.A5(GND) IC33.A6(GND) IC33.A7(GND) IC33.A17(GND) IC33.A27(GND) IC33.A34(GND) IC33.AA1(GND) IC33.AA2(GND) IC33.AA5(GND) IC33.AA7(GND) IC33.AA9(GND) IC33.AA11(GND) IC33.AA13(GND) IC33.AA15(GND) IC33.AA17(GND) IC33.AA19(GND) IC33.AA21(GND) IC33.AA27(GND) IC33.AB3(GND) IC33.AB4(GND) IC33.AB7(GND) IC33.AB8(GND) IC33.AB12(GND) IC33.AB14(GND) IC33.AB16(GND) IC33.AB18(GND) IC33.AB20(GND) IC33.AB22(GND) IC33.AB24(GND) IC33.AB34(GND) IC33.AC1(GND) IC33.AC5(GND) IC33.AC7(GND) IC33.AC11(GND) IC33.AC21(GND) IC33.AC31(GND) IC33.AD4(GND) IC33.AD7(GND) IC33.AD18(GND) IC33.AD28(GND) IC33.AE1(GND) IC33.AE2(GND) IC33.AE5(GND) IC33.AE7(GND) IC33.AE15(GND) IC33.AE25(GND) IC33.AF3(GND) IC33.AF4(GND) IC33.AF7(GND) IC33.AF12(GND) IC33.AF22(GND) IC33.AF32(GND) IC33.AG1(GND) IC33.AG5(GND) IC33.AG7(GND) IC33.AG9(GND) IC33.AG19(GND) IC33.AG29(GND) IC33.AH4(GND) IC33.AH7(GND) IC33.AH16(GND) IC33.AH26(GND) IC33.AJ1(GND) IC33.AJ2(GND) IC33.AJ5(GND) IC33.AJ7(GND) IC33.AJ13(GND) IC33.AJ23(GND) IC33.AJ33(GND) IC33.AK3(GND) IC33.AK4(GND) IC33.AK7(GND) IC33.AK10(GND) IC33.AK20(GND) IC33.AK30(GND) IC33.AL1(GND) IC33.AL5(GND) IC33.AL7(GND) IC33.AL17(GND) IC33.AL27(GND) IC33.AM4(GND) IC33.AM7(GND) IC33.AM8(GND) IC33.AM14(GND) IC33.AM24(GND) IC33.AM34(GND) IC33.AN1(GND) IC33.AN2(GND) IC33.AN5(GND) IC33.AN8(GND) IC33.AN11(GND) IC33.AN21(GND) IC33.AN31(GND) IC33.AP3(GND) IC33.AP4(GND) IC33.AP8(GND) IC33.AP18(GND) IC33.AP28(GND) IC33.AP34(GND) IC33.B3(GND) IC33.B4(GND) IC33.B7(GND) IC33.B14(GND) IC33.B24(GND) IC33.C1(GND) IC33.C5(GND) IC33.C7(GND) IC33.C11(GND) IC33.C21(GND) IC33.C31(GND) IC33.D4(GND) IC33.D7(GND) IC33.D8(GND) IC33.D18(GND) IC33.D28(GND) IC33.E1(GND) IC33.E2(GND) IC33.E5(GND) IC33.E7(GND) IC33.E15(GND) IC33.E25(GND) IC33.F3(GND) IC33.F4(GND) IC33.F7(GND) IC33.F12(GND) IC33.F22(GND) IC33.F32(GND) IC33.G1(GND) IC33.G5(GND) IC33.G7(GND) IC33.G9(GND) IC33.G19(GND) IC33.G29(GND) IC33.H4(GND) IC33.H7(GND) IC33.H16(GND) IC33.H26(GND) IC33.J1(GND) IC33.J2(GND) IC33.J5(GND) IC33.J7(GND) IC33.J8(GND) IC33.J13(GND) IC33.J23(GND) IC33.J33(GND) IC33.K3(GND) IC33.K4(GND) IC33.K7(GND) IC33.K10(GND) IC33.K20(GND) IC33.K30(GND) IC33.L1(GND) IC33.L5(GND) IC33.L7(GND) IC33.L17(GND) IC33.L27(GND) IC33.M4(GND) IC33.M7(GND) IC33.M14(GND) IC33.M20(GND) IC33.M24(GND) IC33.M34(GND) IC33.N1(GND) IC33.N2(GND) IC33.N5(GND) IC33.N7(GND) IC33.N8(VBATT_0) IC33.N9(GND) IC33.N11(GND) IC33.N13(GND) IC33.N15(GND) IC33.N17(GND) IC33.N19(GND) IC33.N21(GND) IC33.N31(GND) IC33.P3(GND) IC33.P4(GND) IC33.P7(GND) IC33.P10(GND) IC33.P12(GND) IC33.P14(GND) IC33.P16(GND) IC33.P18(GND) IC33.P20(GND) IC33.P22(GND) IC33.P28(GND) IC33.R1(GND) IC33.R5(GND) IC33.R7(GND) IC33.R9(GND) IC33.R11(GND) IC33.R13(GND) IC33.R15(GND) IC33.R17(GND) IC33.R19(GND) IC33.R21(GND) IC33.R23(GND) IC33.R25(GND) IC33.T4(GND) IC33.T7(GND) IC33.T8(GND) IC33.T10(GND) IC33.T12(GND) IC33.T14(GND) IC33.T16(GND) IC33.T20(GND) IC33.T22(GND) IC33.T32(GND) IC33.U1(GND) IC33.U2(GND) IC33.U5(GND) IC33.U7(GND) IC33.U9(GND) IC33.U11(GND) IC33.U13(GND) IC33.U15(GND) IC33.U19(GND) IC33.U21(GND) IC33.U29(GND) IC33.V3(GND) IC33.V4(GND) IC33.V7(GND) IC33.V10(GND) IC33.V12(GND) IC33.V14(GND) IC33.V16(GND) IC33.V20(GND) IC33.V22(GND) IC33.V26(GND) IC33.W1(GND) IC33.W5(GND) IC33.W7(GND) IC33.W9(GND) IC33.W11(GND) IC33.W13(GND) IC33.W15(GND) IC33.W19(GND) IC33.W21(GND) IC33.W23(GND) IC33.W33(GND) IC33.Y4(GND) IC33.Y5(GND) IC33.Y6(GND) IC33.Y7(GND) IC33.Y8(VFS_0) IC33.Y10(GND) IC33.Y12(GND) IC33.Y14(GND) IC33.Y16(GND) IC33.Y18(GND) IC33.Y20(GND) IC33.Y22(GND) IC33.Y30(GND) L4.1

### Notes on the sheet
- (near C82) Required 330uF PCB Capacitors:
  LX130T = 2
  LX195T = 4
  LX240T = 4
  LX365T = 6
- Copyright CERN 2014.
  This documentation describes Open Hardware and is licensed under the CERN OHL v. 1.2. You may redistribute and modify this documentation under the terms of the CERN OHL v.1.2. (http://ohwr.org/CERNOHL). This documentation is distributed WITHOUT ANY EXPRESS OR IMPLIED WARRANTY, INCLUDING OF MERCHANTABILITY, SATISFACTORY QUALITY AND FITNESS FOR A PARTICULAR PURPOSE. Please see the CERN OHL v.1.2 for applicable conditions.
- Title:
- Size:
- Revision:
- A3
- Drawn by:
- Date:
- Sheet
- of
- Project:

### Library data of the parts
C69 C70 C73 C83 C87 = CC0402_470NF_16V_10%_X5R: Capacitor; Manufacturer1: TDK; Manufacturer1 PN: C1005X5R1C474K; TC: X5R; Tolerance: ±10%; Voltage: 16V; Published: 8-Jun-2000; LatestRevisionDate: 17-Jul-2002; LatestRevisionNote: Re-released for DXP Platform.; PackageReference: RAD-0.3; Publisher: Altium Limited; Distributor1: Digikey; Distributor1 PN: 445-4976-1-ND; Case: 0402; Value: 470nF
C71 C72 C74 C84 = CC0603_4.7UF_10V_10%_X5R: as C238 on sheet Power_Supply; Published: 8-Jun-2000; LatestRevisionDate: 17-Jul-2002; LatestRevisionNote: Re-released for DXP Platform.; PackageReference: RAD-0.3; Publisher: Altium Limited; Distributor1: Digikey; Distributor1 PN: 445-5170-1-ND; Case: 0603; Value: 4.7uF
C75 C76 C85 C86 = CC0805_22UF_6.3V_20%_X5R: as C247 on sheet Power_Supply; Published: 8-Jun-2000; LatestRevisionDate: 17-Jul-2002; LatestRevisionNote: Re-released for DXP Platform.; PackageReference: RAD-0.3; Publisher: Altium Limited; Distributor1: Digikey; Distributor1 PN: 445-1422-1-ND; Case: 0805; Value: 22uF
C77-C82 = CP2917_330UF_6.3V_20%_TANT: Polarized Capacitor Tantalum; Manufacturer1: Kemet; Manufacturer1 PN: T520D337M006ATE025; Tolerance: ±20%; Voltage: 6.3V; ESR: 25mOhm; Published: 8-Jun-2000; LatestRevisionDate: 17-Jul-2002; LatestRevisionNote: Re-released for DXP Platform.; PackageReference: RB7.6-15; Publisher: Altium Limited; Case: 2917; Distributor1: Digikey; Distributor1 PN: 399-4053-1-ND; TC: Tantalum; Value: 330uF
C88 = CC0402_10NF_25V_10%_X7R: Capacitor; Manufacturer1: TDK; Manufacturer1 PN: C1005X7R1E103K; TC: X7R; Tolerance: ±10%; Voltage: 25V; Published: 8-Jun-2000; LatestRevisionDate: 17-Jul-2002; LatestRevisionNote: Re-released for DXP Platform.; PackageReference: RAD-0.3; Publisher: Altium Limited; Distributor1: Digikey; Distributor1 PN: 445-1260-1-ND; Case: 0402; Value: 10nF
IC33 = XC6VLX130T-1FF1156C: Virtex-6 LXT Platform FPGA, 600 User I/Os, 20 GTXs, 1156-Ball FFBGA, Speed Grade 1, Commercial Grade; FirstPublished: 17-Nov-2009; DatasheetVersion: v2.0, Sep-2009; PackageVersion: ver1.0, Jun-2009; PackageReference: FF1156; Publisher: Altium Limited; PackageDescription: 1156-Ball Flip-Chip Fine Pitch Ball Grid Array (FF1156); Code_JEDEC: MS-034-AAR-1; Code_IPC: BGA100P34X34-1156; ComponentLink1Description: Virtex-6 Datasheet; ComponentLink1URL: http://www.xilinx.com/support/documentation/data_sheets/ds150.pdf; ComponentLink2Description: Pinout Specification; ComponentLink2URL: http://www.xilinx.com/support/packagefiles/virtex-6-pkgs.htm; ComponentLink3Description: FF1156 Package Drawing; ComponentLink3URL: http://www.xilinx.com/support/documentation/package_specs/ff1156.pdf; ComponentLink4Description: Virtex-6 Documents; ComponentLink4URL: http://www.xilinx.com/support/documentation/virtex-6.htm; ComponentLink5Description: Xilinx.com Home; ComponentLink5URL: http://www.xilinx.com
L4 L5 = L_FERRITE_BEAD: ferrite bead; Manufacturer1: Murata; Manufacturer1 PN: BLM18KG221SN1D; Current Rating: 2.2A; DCR: 50mOhm; Case: 0603; Distributor1: Digikey; Distributor1 PN: 490-5255-1-ND

## Sheet QDRII_mem.SchDoc: QDRII_mem
size A4 portrait; Date: 18/06/2014; DrawnBy: J. Gabriel R.E.; Organization: Seven Solutions S.L.; Address1: C/Baza, Parcela 19, Nave 3; Address2: Polígono Ind. Juncaril; Address3: 18210-Peligros-Granada; Address4: Spain; Revision: 3.4; SheetNumber: 20; SheetTotal: 23; WebAddress: www.sevensols.com; Project: White Rabbit; ProjectName: Project Name
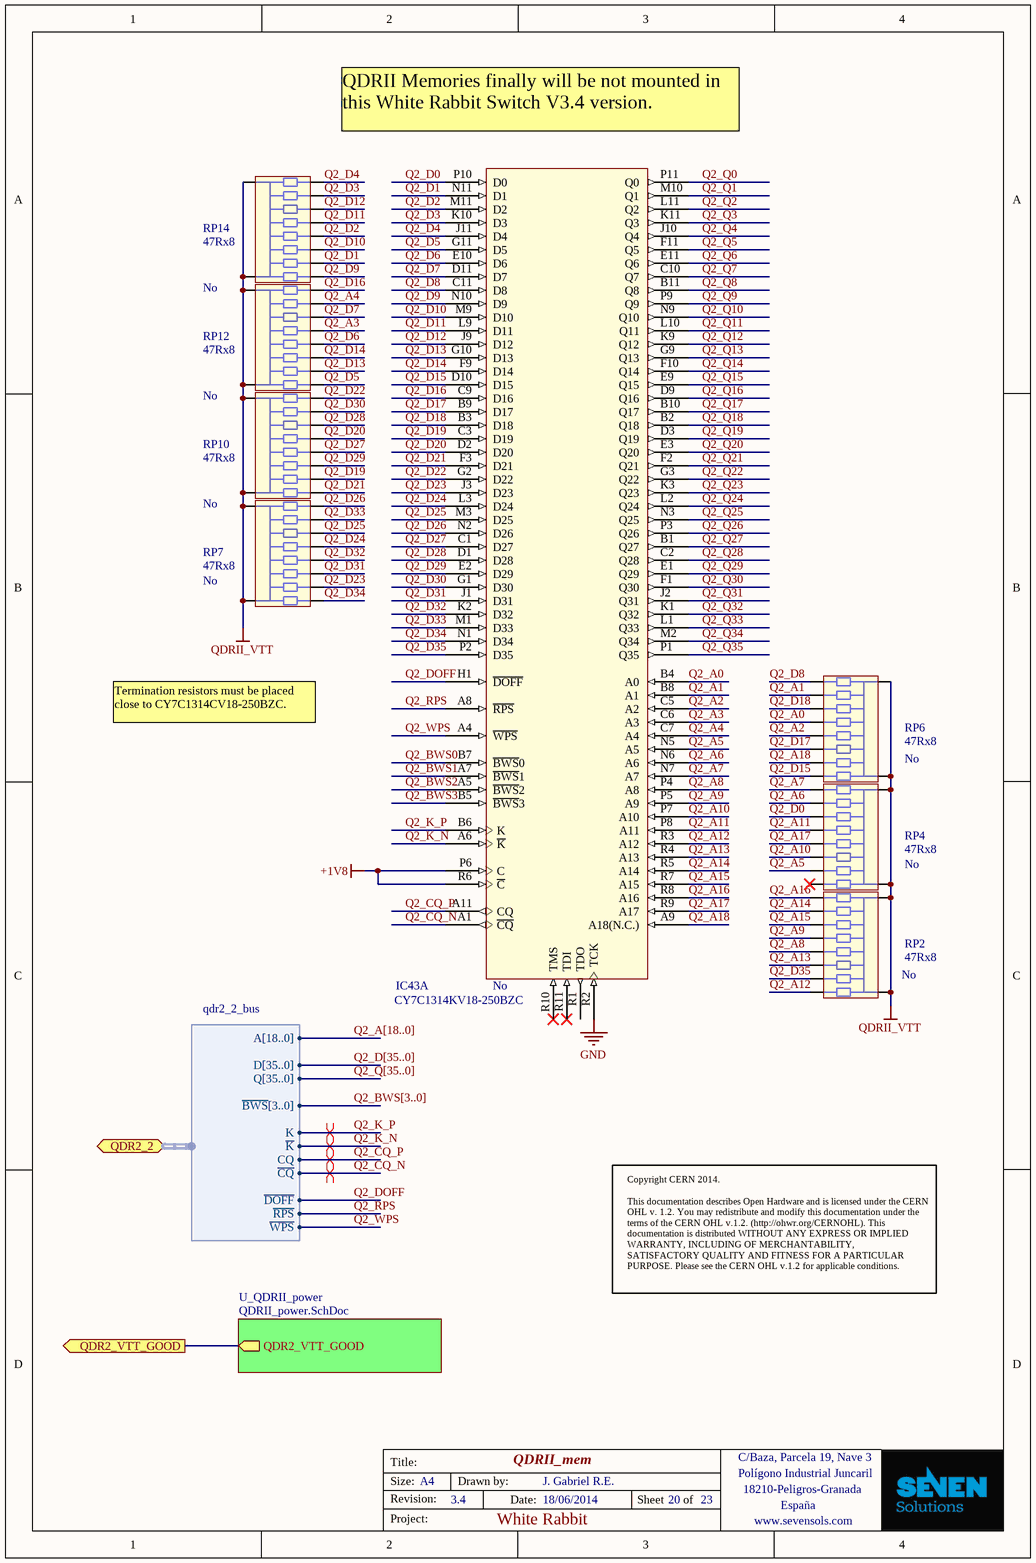
[diagram p18: QDRII_mem.SchDoc]

### Parts
IC43  CY7C1314KV18-250BZC  Mounted: No  [BGA165C100P11X15_1300X1500X140]  (part A of 2)
RP2  value 47Rx8  Mounted: No  [EXBE]  (hidden comment: 47R x 8)
RP4  value 47Rx8  Mounted: No  [EXBE]  (hidden comment: 47R x 8)
RP6  value 47Rx8  Mounted: No  [EXBE]  (hidden comment: 47R x 8)
RP7  value 47Rx8  Mounted: No  [EXBE]  (hidden comment: 47R x 8)
RP10  value 47Rx8  Mounted: No  [EXBE]  (hidden comment: 47R x 8)
RP12  value 47Rx8  Mounted: No  [EXBE]  (hidden comment: 47R x 8)
RP14  value 47Rx8  Mounted: No  [EXBE]  (hidden comment: 47R x 8)

### Sub-sheets
U_QDRII_power = QDRII_power.SchDoc: QDR2_VTT_GOOD (out)

### Ports
QDR2_2 (harness qdr2_2_bus), QDR2_VTT_GOOD (out)

### Harnesses
qdr2_2_bus: A[18..0], ~{BWS}[3..0], ~{CQ}, CQ, D[35..0], ~{DOFF}, K, ~{K}, Q[35..0], ~{RPS}, ~{WPS}

### Nets
+1V8: IC43.P6(C) IC43.R6(~{C})
GND: IC43.R2(TCK)
QDRII_VTT: RP2.1 RP2.6 RP4.1 RP4.6 RP6.1 RP6.6 RP7.1 RP7.6 RP10.1 RP10.6 RP12.1 RP12.6 RP14.1 RP14.6
Q2_A0: IC43.B4(A0) RP6.8
Q2_A1: IC43.B8(A1) RP6.10
Q2_A2: IC43.C5(A2) RP6.9
Q2_A3: IC43.C6(A3) RP12.7
Q2_A4: IC43.C7(A4) RP12.9
Q2_A5: IC43.N5(A5) RP4.8
Q2_A6: IC43.N6(A6) RP4.9
Q2_A7: IC43.N7(A7) RP4.10
Q2_A8: IC43.P4(A8) RP2.5
Q2_A9: IC43.P5(A9) RP2.8
Q2_A10: IC43.P7(A10) RP4.2
Q2_A11: IC43.P8(A11) RP4.3
Q2_A12: IC43.R3(A12) RP2.2
Q2_A13: IC43.R4(A13) RP2.4
Q2_A14: IC43.R5(A14) RP2.7
Q2_A15: IC43.R7(A15) RP2.9
Q2_A16: IC43.R8(A16) RP2.10
Q2_A17: IC43.R9(A17) RP4.4
Q2_A18: IC43.A9(A18(N.C.)) RP6.3
Q2_BWS0: IC43.B7(~{BWS}0)
Q2_BWS1: IC43.A7(~{BWS}1)
Q2_BWS2: IC43.A5(~{BWS}2)
Q2_BWS3: IC43.B5(~{BWS}3)
Q2_CQ_N: IC43.A1(~{CQ}) ; port QDR2_2.~{CQ}
Q2_CQ_P: IC43.A11(CQ) ; port QDR2_2.CQ
Q2_D0: IC43.P10(D0) RP4.5
Q2_D1: IC43.N11(D1) RP14.3
Q2_D2: IC43.M11(D2) RP14.5
Q2_D3: IC43.K10(D3) RP14.9
Q2_D4: IC43.J11(D4) RP14.10
Q2_D5: IC43.G11(D5) RP12.2
Q2_D6: IC43.E10(D6) RP12.5
Q2_D7: IC43.D11(D7) RP12.8
Q2_D8: IC43.C11(D8) RP6.5
Q2_D9: IC43.N10(D9) RP14.2
Q2_D10: IC43.M9(D10) RP14.4
Q2_D11: IC43.L9(D11) RP14.7
Q2_D12: IC43.J9(D12) RP14.8
Q2_D13: IC43.G10(D13) RP12.3
Q2_D14: IC43.F9(D14) RP12.4
Q2_D15: IC43.D10(D15) RP6.4
Q2_D16: IC43.C9(D16) RP12.10
Q2_D17: IC43.B9(D17) RP6.2
Q2_D18: IC43.B3(D18) RP6.7
Q2_D19: IC43.C3(D19) RP10.7
Q2_D20: IC43.D2(D20) RP10.9
Q2_D21: IC43.F3(D21) RP10.3
Q2_D22: IC43.G2(D22) RP10.5
Q2_D23: IC43.J3(D23) RP7.7
Q2_D24: IC43.L3(D24) RP7.10
Q2_D25: IC43.M3(D25) RP7.2
Q2_D26: IC43.N2(D26) RP7.4
Q2_D27: IC43.C1(D27) RP10.8
Q2_D28: IC43.D1(D28) RP10.10
Q2_D29: IC43.E2(D29) RP10.2
Q2_D30: IC43.G1(D30) RP10.4
Q2_D31: IC43.J1(D31) RP7.8
Q2_D32: IC43.K2(D32) RP7.9
Q2_D33: IC43.M1(D33) RP7.3
Q2_D34: IC43.N1(D34) RP7.5
Q2_D35: IC43.P2(D35) RP2.3
Q2_DOFF: IC43.H1(~{DOFF}) ; port QDR2_2.~{DOFF}
Q2_K_N: IC43.A6(~{K}) ; port QDR2_2.~{K}
Q2_K_P: IC43.B6(K) ; port QDR2_2.K
Q2_Q0: IC43.P11(Q0)
Q2_Q1: IC43.M10(Q1)
Q2_Q2: IC43.L11(Q2)
Q2_Q3: IC43.K11(Q3)
Q2_Q4: IC43.J10(Q4)
Q2_Q5: IC43.F11(Q5)
Q2_Q6: IC43.E11(Q6)
Q2_Q7: IC43.C10(Q7)
Q2_Q8: IC43.B11(Q8)
Q2_Q9: IC43.P9(Q9)
Q2_Q10: IC43.N9(Q10)
Q2_Q11: IC43.L10(Q11)
Q2_Q12: IC43.K9(Q12)
Q2_Q13: IC43.G9(Q13)
Q2_Q14: IC43.F10(Q14)
Q2_Q15: IC43.E9(Q15)
Q2_Q16: IC43.D9(Q16)
Q2_Q17: IC43.B10(Q17)
Q2_Q18: IC43.B2(Q18)
Q2_Q19: IC43.D3(Q19)
Q2_Q20: IC43.E3(Q20)
Q2_Q21: IC43.F2(Q21)
Q2_Q22: IC43.G3(Q22)
Q2_Q23: IC43.K3(Q23)
Q2_Q24: IC43.L2(Q24)
Q2_Q25: IC43.N3(Q25)
Q2_Q26: IC43.P3(Q26)
Q2_Q27: IC43.B1(Q27)
Q2_Q28: IC43.C2(Q28)
Q2_Q29: IC43.E1(Q29)
Q2_Q30: IC43.F1(Q30)
Q2_Q31: IC43.J2(Q31)
Q2_Q32: IC43.K1(Q32)
Q2_Q33: IC43.L1(Q33)
Q2_Q34: IC43.M2(Q34)
Q2_Q35: IC43.P1(Q35)
Q2_RPS: IC43.A8(~{RPS}) ; port QDR2_2.~{RPS}
Q2_WPS: IC43.A4(~{WPS}) ; port QDR2_2.~{WPS}
QDR2_VTT_GOOD: port QDR2_VTT_GOOD, sheet U_QDRII_power/QDR2_VTT_GOOD

Not connected (* = marked no-connect by the designer): IC43 R1(TDO) R10(TMS)* R11(TDI)*; RP4 7*

### Buses and harness runs
bus Q2_A[18..0]
bus Q2_BWS[3..0]
bus Q2_D[35..0]
bus Q2_Q[35..0]

### Layout directives
differential pair: Q2_CQ_N, Q2_CQ_P, Q2_K_N, Q2_K_P

### Notes on the sheet
- QDRII Memories finally will be not mounted in this White Rabbit Switch V3.4 version.
- Termination resistors must be placed close to CY7C1314CV18-250BZC.
- Copyright CERN 2014.
  This documentation describes Open Hardware and is licensed under the CERN OHL v. 1.2. You may redistribute and modify this documentation under the terms of the CERN OHL v.1.2. (http://ohwr.org/CERNOHL). This documentation is distributed WITHOUT ANY EXPRESS OR IMPLIED WARRANTY, INCLUDING OF MERCHANTABILITY, SATISFACTORY QUALITY AND FITNESS FOR A PARTICULAR PURPOSE. Please see the CERN OHL v.1.2 for applicable conditions.
- Title:
- Size:
- Revision:
- A4
- Drawn by:
- Date:
- Sheet
- of
- C/Baza, Parcela 19, Nave 3
- Polígono Industrial Juncaril
- 18210-Peligros-Granada
- España
- Project:
- www.sevensols.com

### Library data of the parts
IC43 = CY7C1314CV18: 18-Mbit (512Kx36) QDRII SRAM 2-Word Burst Architecture; Value: CY7C1314KV18-250BZC; Distributor1 PN: CY7C1314KV18-250BZC-ND; Distributor1: Digikey
RP2 RP4 RP6 RP7 RP10 RP12 RP14 = EXB-E10C470J: 47R, 62.5mW Chip Resistor Bussed Network; Manufacturer1: Panasonic; Tolerance: ±5%; TCR: 200ppm; Case: EXBE; Manufacturer1 PN: EXB-E10C470J; Distributor1: DigiKey; Distributor1 PN: U8470CT-ND; Power Rating: 62.5mW

## Sheet QDRII_power.SchDoc: QDRII_power
size A4; Date: 18/06/2014; DrawnBy: J. Gabriel R.E.; Organization: Seven Solutions S.L.; Address1: C/Baza, Parcela 19, Nave 3; Address2: Polígono Ind. Juncaril; Address3: 18210-Peligros-Granada; Address4: Spain; Revision: 3.4; SheetNumber: 21; SheetTotal: 23; WebAddress: www.sevensols.com; Project: White Rabbit; ProjectName: White Rabbit
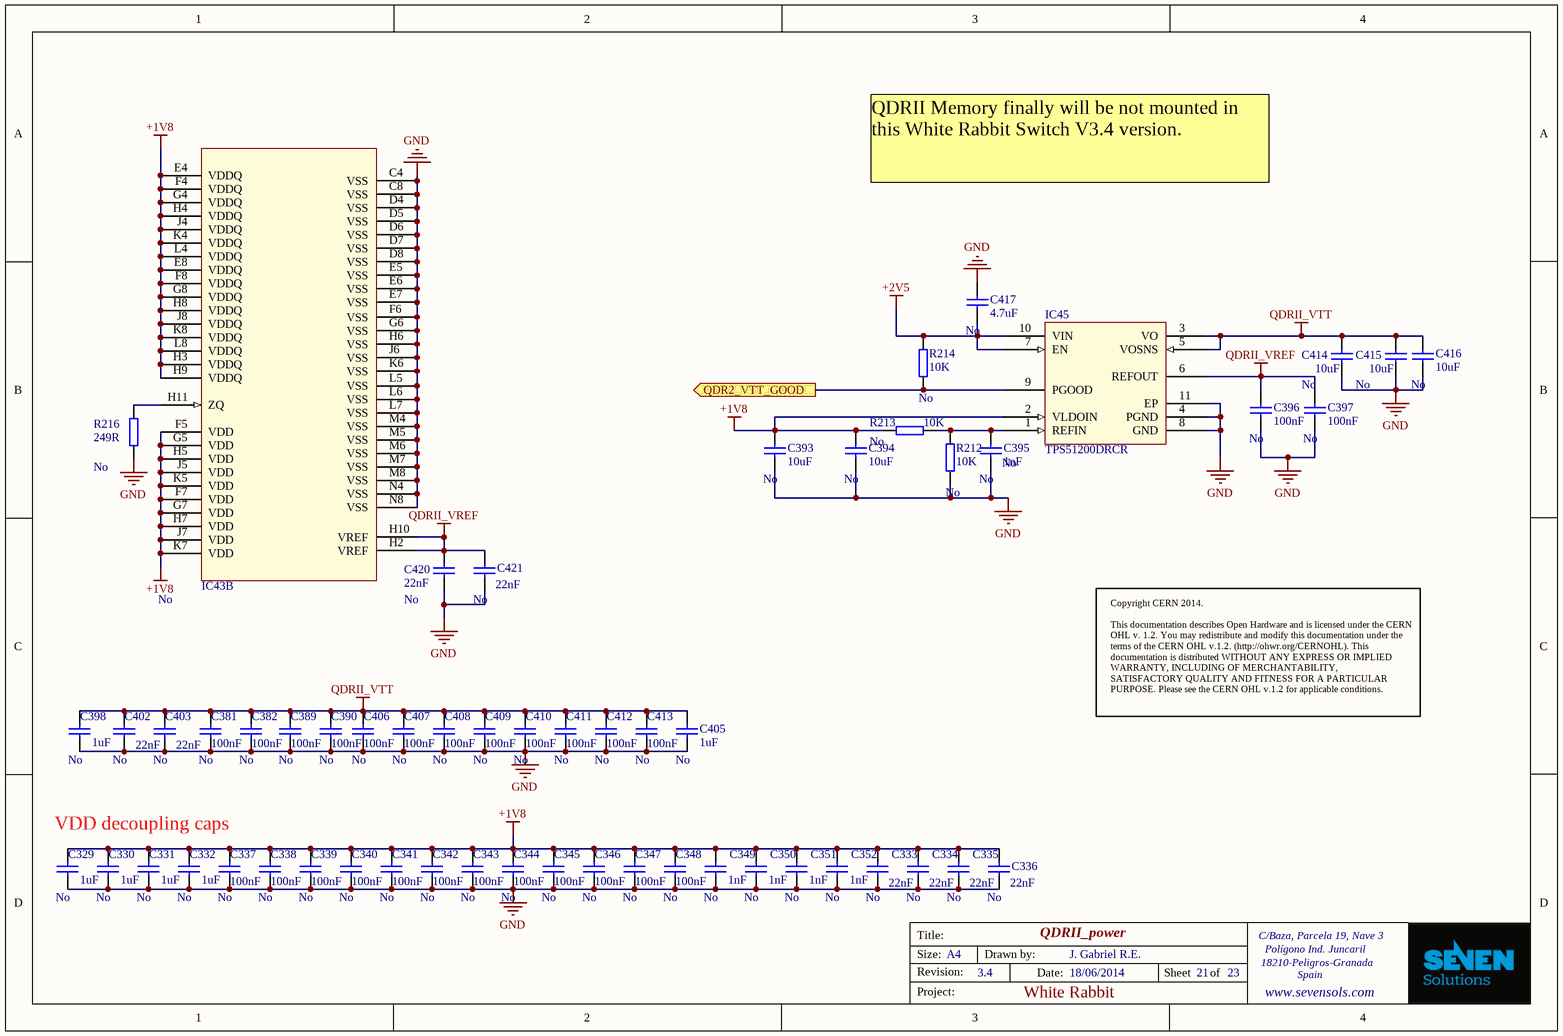
[diagram p19: QDRII_power.SchDoc]

### Parts
C329  Mounted: No  [CC1005-0402]  (hidden comment: 1uF)
C330  Mounted: No  [CC1005-0402]  (hidden comment: 1uF)
C331  Mounted: No  [CC1005-0402]  (hidden comment: 1uF)
C332  Mounted: No  [CC1005-0402]  (hidden comment: 1uF)
C333  Mounted: No  [CC1005-0402]  (hidden comment: 22nF)
C334  Mounted: No  [CC1005-0402]  (hidden comment: 22nF)
C335  Mounted: No  [CC1005-0402]  (hidden comment: 22nF)
C336  Mounted: No  [CC1005-0402]  (hidden comment: 22nF)
C337  Mounted: No  [CC1005-0402]  (hidden comment: 100nF)
C338  Mounted: No  [CC1005-0402]  (hidden comment: 100nF)
C339  Mounted: No  [CC1005-0402]  (hidden comment: 100nF)
C340  Mounted: No  [CC1005-0402]  (hidden comment: 100nF)
C341  Mounted: No  [CC1005-0402]  (hidden comment: 100nF)
C342  Mounted: No  [CC1005-0402]  (hidden comment: 100nF)
C343  Mounted: No  [CC1005-0402]  (hidden comment: 100nF)
C344  Mounted: No  [CC1005-0402]  (hidden comment: 100nF)
C345  Mounted: No  [CC1005-0402]  (hidden comment: 100nF)
C346  Mounted: No  [CC1005-0402]  (hidden comment: 100nF)
C347  Mounted: No  [CC1005-0402]  (hidden comment: 100nF)
C348  Mounted: No  [CC1005-0402]  (hidden comment: 100nF)
C349  Mounted: No  [CC1005-0402]  (hidden comment: 1nF)
C350  Mounted: No  [CC1005-0402]  (hidden comment: 1nF)
C351  Mounted: No  [CC1005-0402]  (hidden comment: 1nF)
C352  Mounted: No  [CC1005-0402]  (hidden comment: 1nF)
C381  Mounted: No  [CC1005-0402]  (hidden comment: 100nF)
C382  Mounted: No  [CC1005-0402]  (hidden comment: 100nF)
C389  Mounted: No  [CC1005-0402]  (hidden comment: 100nF)
C390  Mounted: No  [CC1005-0402]  (hidden comment: 100nF)
C393  Mounted: No  [CC1608-0603]  (hidden comment: 10uF)
C394  Mounted: No  [CC1608-0603]  (hidden comment: 10uF)
C395  Mounted: No  [CC1005-0402]  (hidden comment: 1nF)
C396  Mounted: No  [CC1005-0402]  (hidden comment: 100nF)
C397  Mounted: No  [CC1005-0402]  (hidden comment: 100nF)
C398  Mounted: No  [CC1005-0402]  (hidden comment: 1uF)
C402  Mounted: No  [CC1005-0402]  (hidden comment: 22nF)
C403  Mounted: No  [CC1005-0402]  (hidden comment: 22nF)
C405  Mounted: No  [CC1005-0402]  (hidden comment: 1uF)
C406  Mounted: No  [CC1005-0402]  (hidden comment: 100nF)
C407  Mounted: No  [CC1005-0402]  (hidden comment: 100nF)
C408  Mounted: No  [CC1005-0402]  (hidden comment: 100nF)
C409  Mounted: No  [CC1005-0402]  (hidden comment: 100nF)
C410  Mounted: No  [CC1005-0402]  (hidden comment: 100nF)
C411  Mounted: No  [CC1005-0402]  (hidden comment: 100nF)
C412  Mounted: No  [CC1005-0402]  (hidden comment: 100nF)
C413  Mounted: No  [CC1005-0402]  (hidden comment: 100nF)
C414  Mounted: No  [CC1608-0603]  (hidden comment: 10uF)
C415  Mounted: No  [CC1608-0603]  (hidden comment: 10uF)
C416  Mounted: No  [CC1608-0603]  (hidden comment: 10uF)
C417  Mounted: No  [CC1608-0603]  (hidden comment: 4.7uF)
C420  Mounted: No  [CC1005-0402]  (hidden comment: 22nF)
C421  Mounted: No  [CC1005-0402]  (hidden comment: 22nF)
IC43  Mounted: No  [BGA165C100P11X15_1300X1500X140]  (hidden comment: CY7C1314KV18-250BZC)  (part B of 2)
IC45  TPS51200DRCR  Mounted: No  [SON50P300X300X100-11N-R175X250]
R212  Mounted: No  [0402]  (hidden comment: 10k)
R213  Mounted: No  [0402]  (hidden comment: 10k)
R214  Mounted: No  [0402]  (hidden comment: 10k)
R216  Mounted: No  [0402]  (hidden comment: 249R)

### Ports
QDR2_VTT_GOOD (out)

### Nets
+1V8: C329.2 C330.2 C331.2 C332.2 C333.2 C334.2 C335.2 C336.2 C337.1 C338.1 C339.1 C340.1 C341.1 C342.1 C343.1 C344.1 C345.1 C346.1 C347.1 C348.1 C349.2 C350.2 C351.2 C352.2 C393.2 C394.2 IC43.E4(VDDQ) IC43.E8(VDDQ) IC43.F4(VDDQ) IC43.F5(VDD) IC43.F7(VDD) IC43.F8(VDDQ) IC43.G4(VDDQ) IC43.G5(VDD) IC43.G7(VDD) IC43.G8(VDDQ) IC43.H3(VDDQ) IC43.H4(VDDQ) IC43.H5(VDD) IC43.H7(VDD) IC43.H8(VDDQ) IC43.H9(VDDQ) IC43.J4(VDDQ) IC43.J5(VDD) IC43.J7(VDD) IC43.J8(VDDQ) IC43.K4(VDDQ) IC43.K5(VDD) IC43.K7(VDD) IC43.K8(VDDQ) IC43.L4(VDDQ) IC43.L8(VDDQ) IC45.2(VLDOIN) R213.2
+2V5: C417.1 IC45.7(EN) IC45.10(VIN) R214.2
GND: C329.1 C330.1 C331.1 C332.1 C333.1 C334.1 C335.1 C336.1 C337.2 C338.2 C339.2 C340.2 C341.2 C342.2 C343.2 C344.2 C345.2 C346.2 C347.2 C348.2 C349.1 C350.1 C351.1 C352.1 C381.2 C382.2 C389.2 C390.2 C393.1 C394.1 C395.1 C396.2 C397.2 C398.1 C402.1 C403.1 C405.1 C406.2 C407.2 C408.2 C409.2 C410.2 C411.2 C412.2 C413.2 C414.1 C415.1 C416.1 C417.2 C420.1 C421.1 IC43.C4(VSS) IC43.C8(VSS) IC43.D4(VSS) IC43.D5(VSS) IC43.D6(VSS) IC43.D7(VSS) IC43.D8(VSS) IC43.E5(VSS) IC43.E6(VSS) IC43.E7(VSS) IC43.F6(VSS) IC43.G6(VSS) IC43.H6(VSS) IC43.J6(VSS) IC43.K6(VSS) IC43.L5(VSS) IC43.L6(VSS) IC43.L7(VSS) IC43.M4(VSS) IC43.M5(VSS) IC43.M6(VSS) IC43.M7(VSS) IC43.M8(VSS) IC43.N4(VSS) IC43.N8(VSS) IC45.4(PGND) IC45.8(GND) IC45.11(EP) R212.1 R216.1
QDRII_VREF: C396.1 C397.1 C420.2 C421.2 IC43.H2(VREF) IC43.H10(VREF) IC45.6(REFOUT)  [project net VREFQDRII]
QDRII_VTT: C381.1 C382.1 C389.1 C390.1 C398.2 C402.2 C403.2 C405.2 C406.1 C407.1 C408.1 C409.1 C410.1 C411.1 C412.1 C413.1 C414.2 C415.2 C416.2 IC45.3(VO) IC45.5(VOSNS)
QDR2_VTT_GOOD: IC45.9(PGOOD) R214.1 ; port QDR2_VTT_GOOD
NetC395_2: C395.2 IC45.1(REFIN) R212.2 R213.1
NetIC43_H11: IC43.H11(ZQ) R216.2

### Notes on the sheet
- QDRII Memory finally will be not mounted in this White Rabbit Switch V3.4 version.
- Copyright CERN 2014.
  This documentation describes Open Hardware and is licensed under the CERN OHL v. 1.2. You may redistribute and modify this documentation under the terms of the CERN OHL v.1.2. (http://ohwr.org/CERNOHL). This documentation is distributed WITHOUT ANY EXPRESS OR IMPLIED WARRANTY, INCLUDING OF MERCHANTABILITY, SATISFACTORY QUALITY AND FITNESS FOR A PARTICULAR PURPOSE. Please see the CERN OHL v.1.2 for applicable conditions.
- VDD decoupling caps
- Title:
- Size:
- Revision:
- A4
- Drawn by:
- Date:
- Sheet
- of
- Project:

### Library data of the parts
C329-C332 C398 C405 = CC0402_1UF_16V_10%_X5R: as C235-C237 on sheet Power_Supply; Published: 8-Jun-2000; LatestRevisionDate: 17-Jul-2002; LatestRevisionNote: Re-released for DXP Platform.; PackageReference: RAD-0.3; Publisher: Altium Limited; Distributor1: Digikey; Distributor1 PN: 445-4978-1-ND; Case: 0402; Value: 1uF
C333-C336 C402 C403 C420 C421 = CC0402_22NF_25V_10%_X7R: Capacitor; Manufacturer1: TDK; Manufacturer1 PN: C1005X7R1E223K; TC: X7R; Tolerance: ±10%; Voltage: 25V; Published: 8-Jun-2000; LatestRevisionDate: 17-Jul-2002; LatestRevisionNote: Re-released for DXP Platform.; PackageReference: RAD-0.3; Publisher: Altium Limited; Distributor1: Digikey; Distributor1 PN: 445-1261-1-ND; Case: 0402; Value: 22nF
C337-C348 C381 C382 C389 C390 C396 C397 C406-C413 = CC0402_100NF_16V_10%_X7R: as C207 on sheet Power_Supply; Published: 8-Jun-2000; LatestRevisionDate: 17-Jul-2002; LatestRevisionNote: Re-released for DXP Platform.; PackageReference: RAD-0.3; Publisher: Altium Limited; Distributor1: Digikey; Distributor1 PN: 445-4952-1-ND; Case: 0402; Value: 100nF
C349-C352 C395 = CC0402_1NF_25V_10%_X7R: Capacitor; Manufacturer1: TDK; Manufacturer1 PN: C1005X7R1E102K; TC: X7R; Tolerance: ±10%; Voltage: 25V; Published: 8-Jun-2000; LatestRevisionDate: 17-Jul-2002; LatestRevisionNote: Re-released for DXP Platform.; PackageReference: RAD-0.3; Publisher: Altium Limited; Distributor1: Digikey; Distributor1 PN: 445-4924-1-ND; Case: 0402; Value: 1nF
C393 C394 C414-C416 = CC0603_10UF_6.3V_20%_X5R: Capacitor; Manufacturer1: TDK; Manufacturer1 PN: C1608X5R0J106M; TC: X5R; Tolerance: ±20%; Voltage: 6.3V; Published: 8-Jun-2000; LatestRevisionDate: 17-Jul-2002; LatestRevisionNote: Re-released for DXP Platform.; PackageReference: RAD-0.3; Publisher: Altium Limited; Distributor1: Digikey; Distributor1 PN: 445-4112-1-ND; Case: 0603; Value: 10uF
C417 = CC0603_4.7UF_10V_10%_X5R: as C238 on sheet Power_Supply; Published: 8-Jun-2000; LatestRevisionDate: 17-Jul-2002; LatestRevisionNote: Re-released for DXP Platform.; PackageReference: RAD-0.3; Publisher: Altium Limited; Distributor1: Digikey; Distributor1 PN: 445-5170-1-ND; Case: 0603; Value: 4.7uF
IC43 = CY7C1314CV18: as IC43 on sheet QDRII_mem; Value: CY7C1314KV18-250BZC; Distributor1 PN: CY7C1314KV18-250BZC -ND; Distributor1: Digikey
IC45 = TPS51200: Sink/Source DDR Termination Regulator; Value: TPS51200DRCR; Distributor1 PN: 296-26978-1-ND; Distributor1: Digikey
R212-R214 = R0402_10K_±1%_0.1W_100PPM: as R181 on sheet Power_Supply; Case: 0402; Distributor1: DigiKey; Distributor1 PN: P10.0KLCT-ND; Value: 10K
R216 = R0402_249R_±1%_0.1W_100PPM: SMD Resistor; Manufacturer1: Panasonic; Manufacturer1 PN: ERJ-2RKF2490X; TCR: 100ppm; Power Rating: 0.1W; Tolerance: ±1%; Case: 0402; Distributor1: DigiKey; Distributor1 PN: P249LCT-ND; Value: 249R